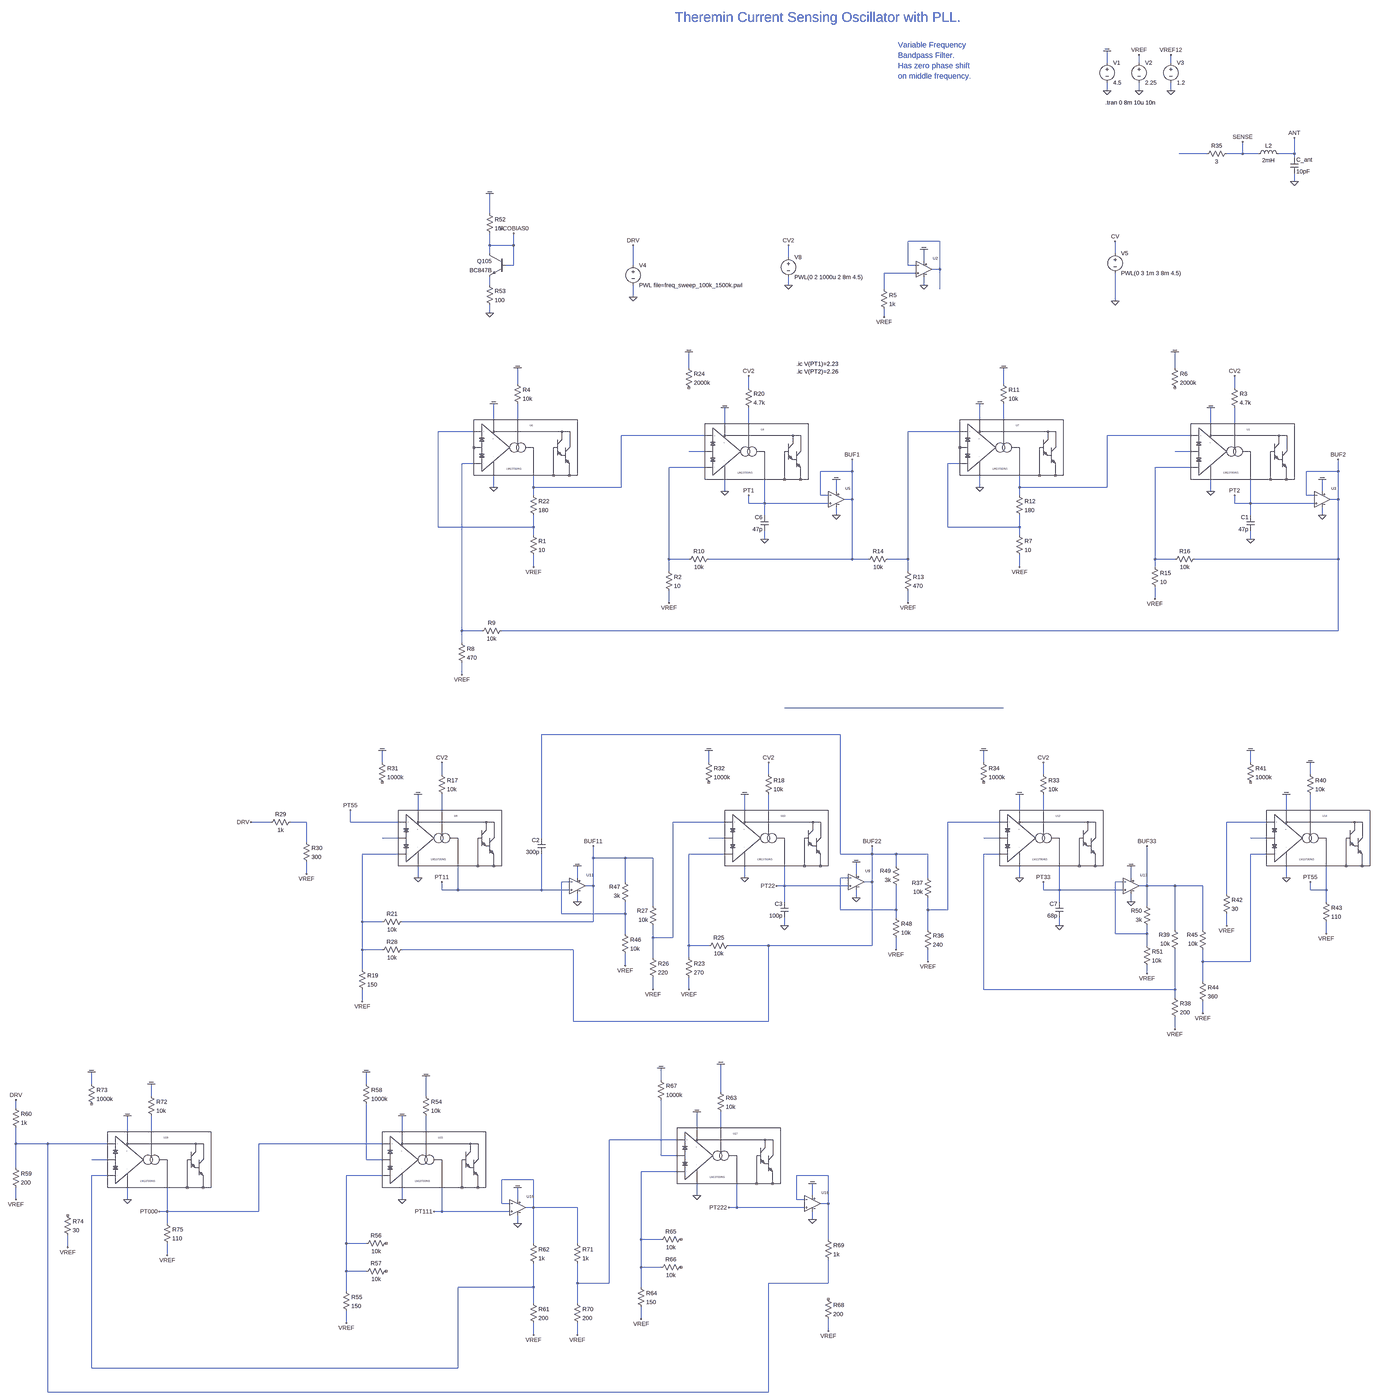
[diagram p0: schematic vco_and_lc_drive_v17.asc, whole sheet]
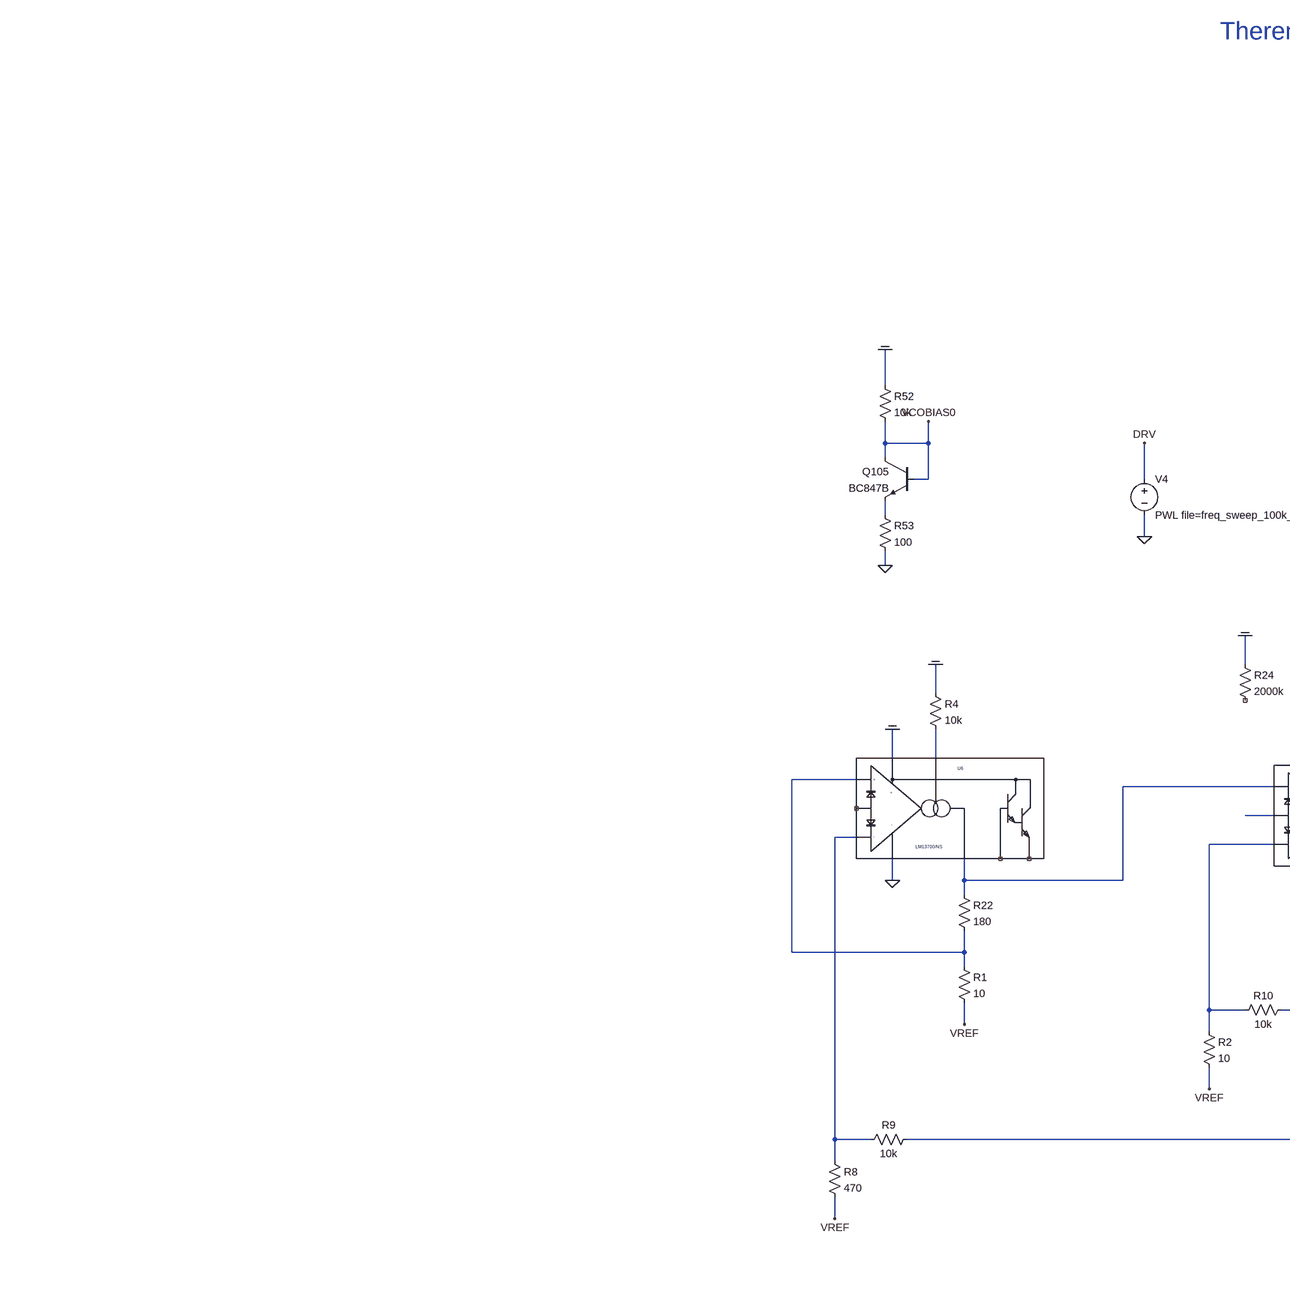
[diagram p1: schematic vco_and_lc_drive_v17.asc, part, row 1 of 2, column 1 of 2]
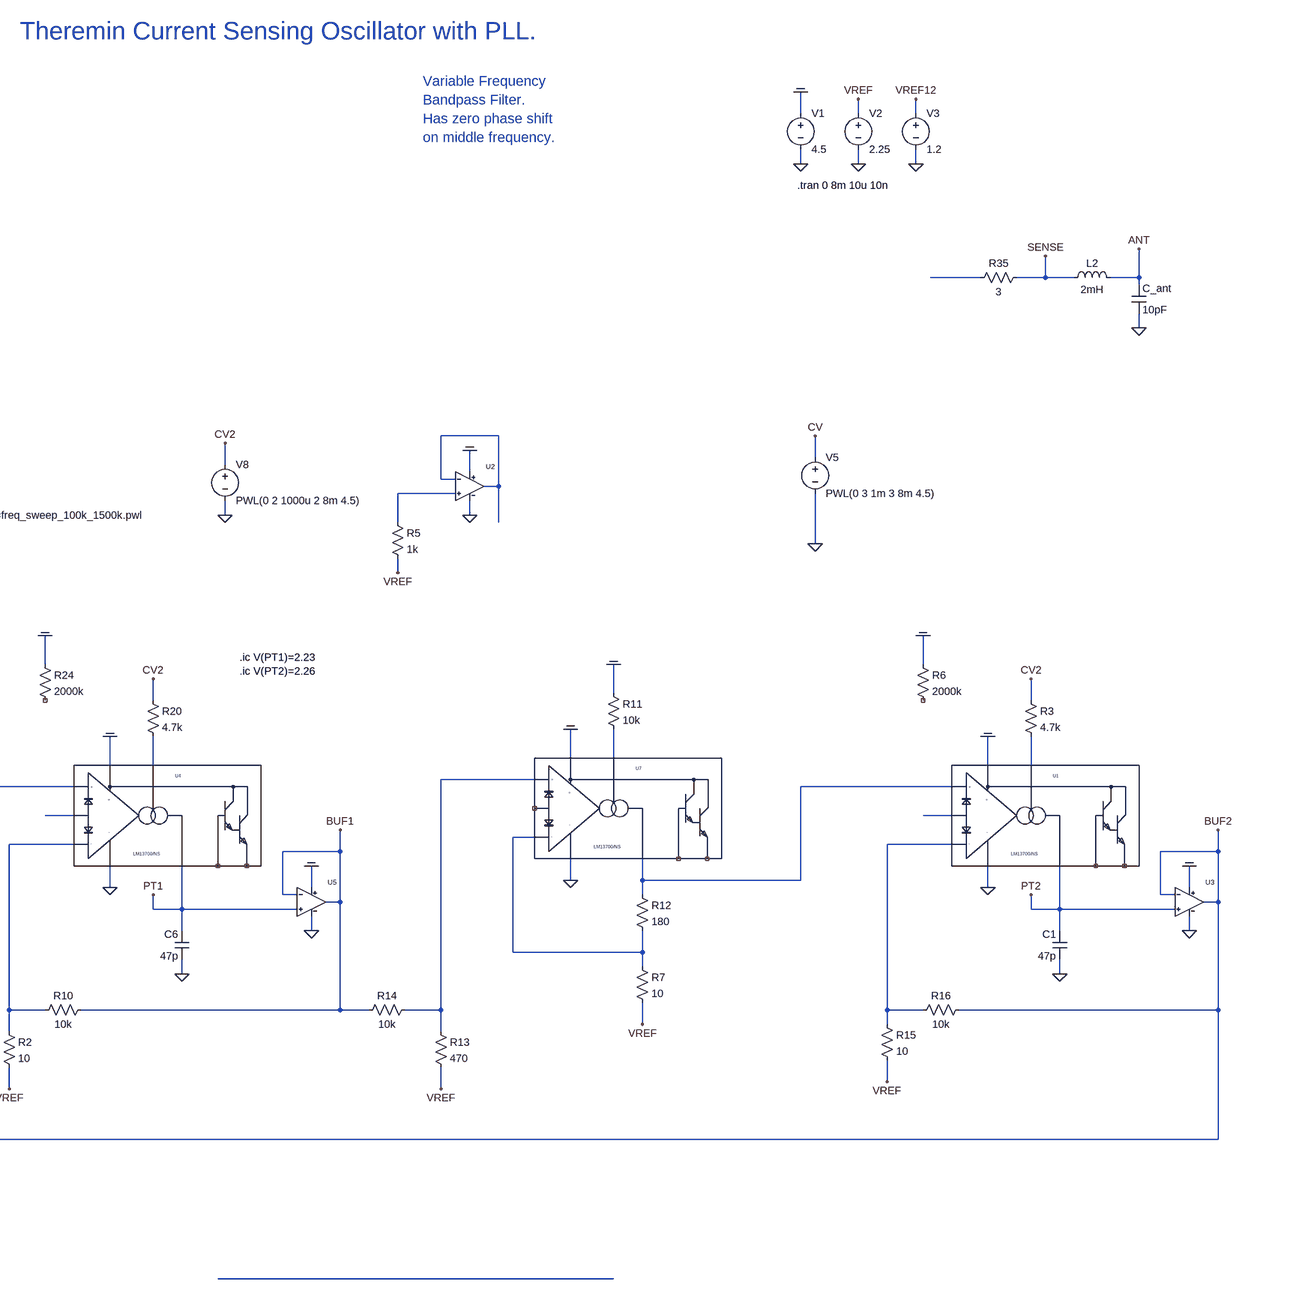
[diagram p2: schematic vco_and_lc_drive_v17.asc, part, row 1 of 2, column 2 of 2]
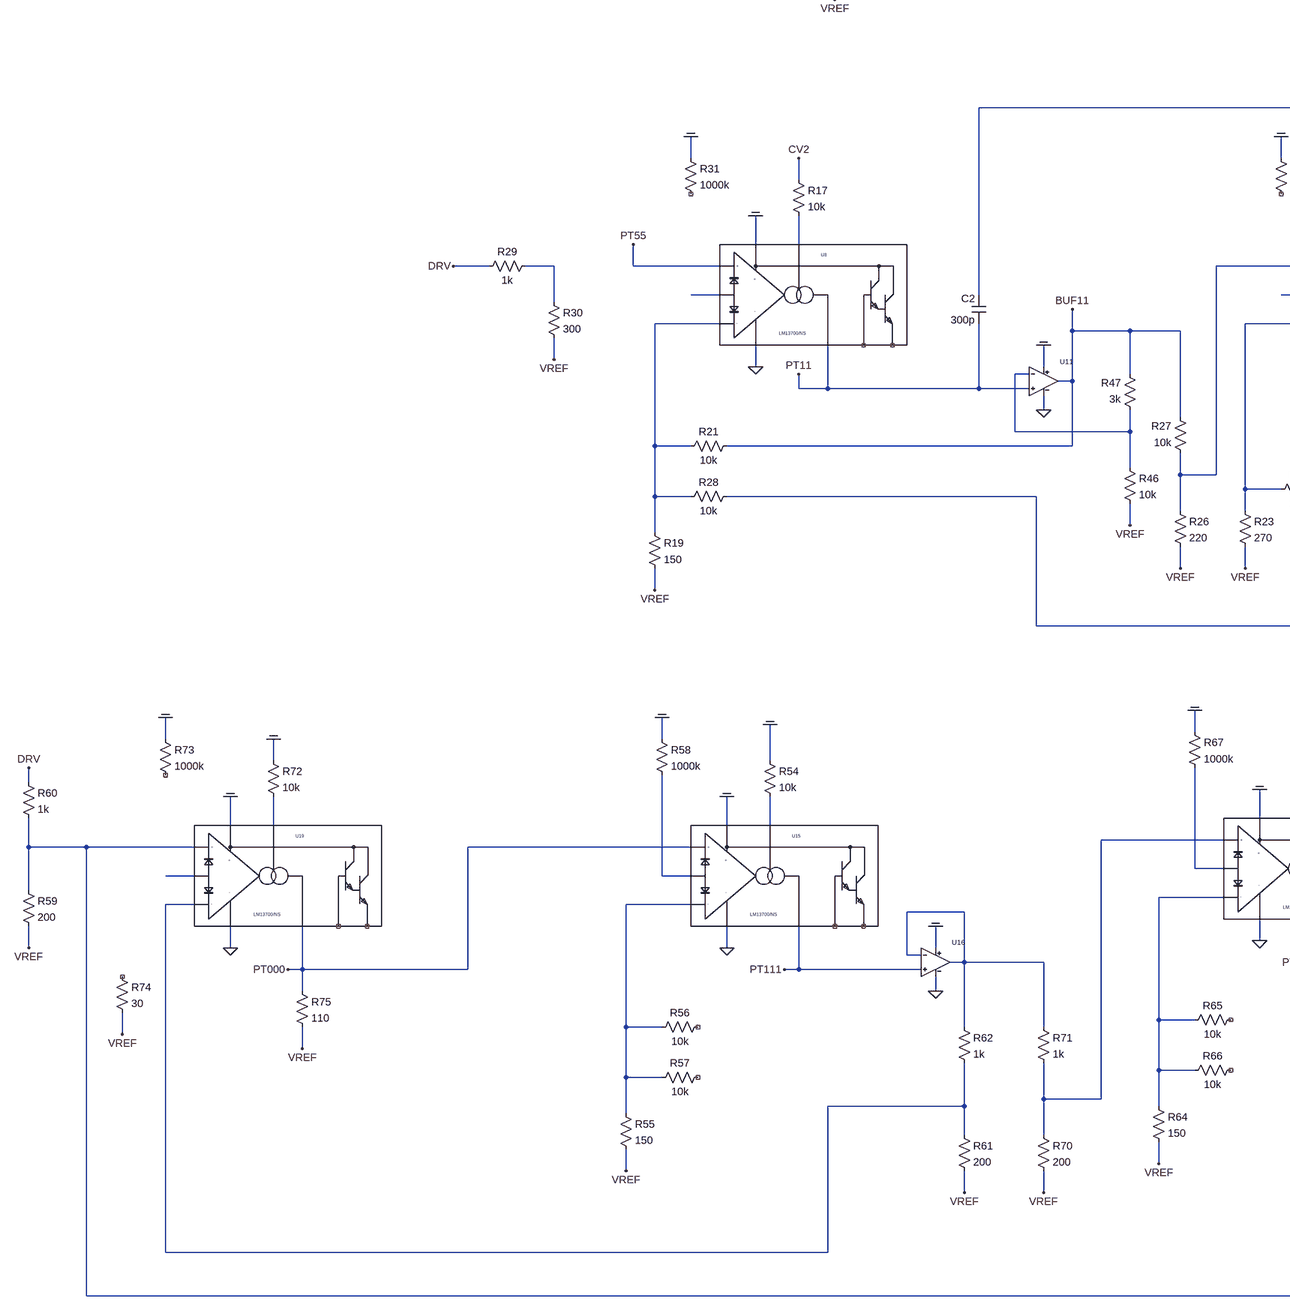
[diagram p3: schematic vco_and_lc_drive_v17.asc, part, row 2 of 2, column 1 of 2]
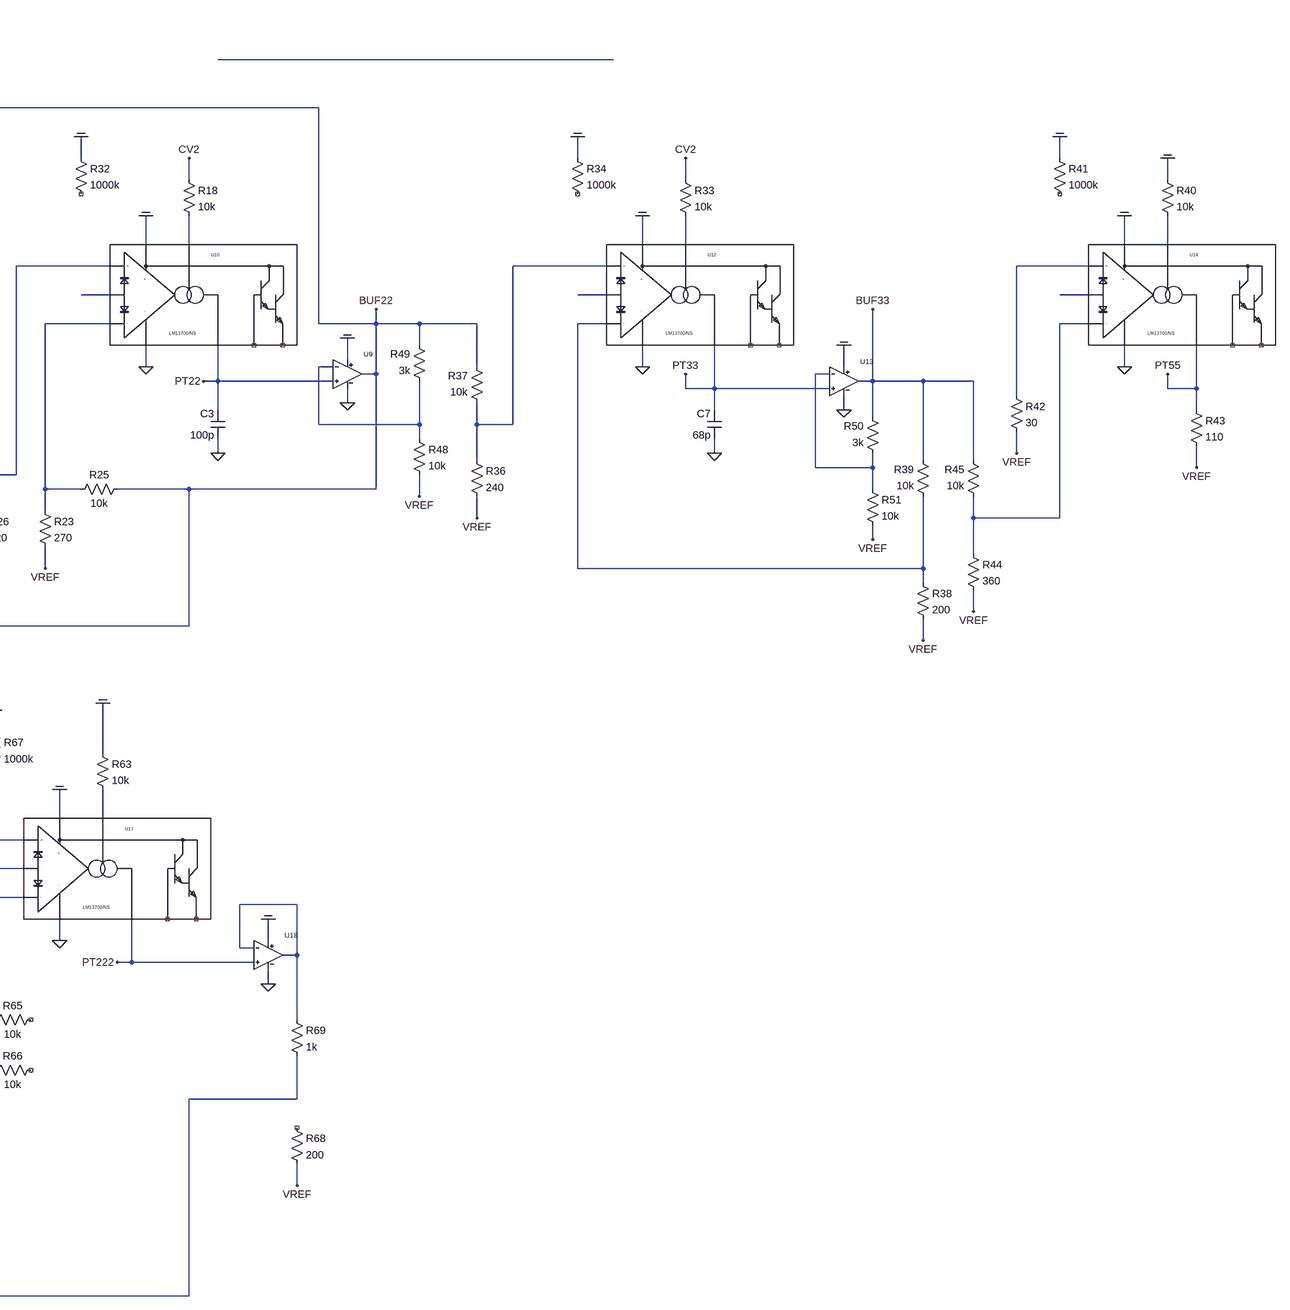
[diagram p4: schematic vco_and_lc_drive_v17.asc, part, row 2 of 2, column 2 of 2]
vco_and_lc_drive_v17.asc, the LTspice schematic file:
Version 4
SHEET 1 13504 29468
WIRE -5600 19072 -5600 19024
WIRE -5472 19072 -5472 19040
WIRE -5344 19072 -5344 19040
WIRE -5600 19184 -5600 19152
WIRE -5472 19184 -5472 19152
WIRE -5344 19184 -5344 19152
WIRE -5200 19440 -5312 19440
WIRE -5056 19440 -5056 19392
WIRE -5056 19440 -5120 19440
WIRE -4992 19440 -5056 19440
WIRE -4848 19440 -4848 19376
WIRE -4848 19440 -4912 19440
WIRE -4848 19456 -4848 19440
WIRE -4848 19552 -4848 19520
WIRE -8080 19680 -8080 19600
WIRE -6272 19792 -6400 19792
WIRE -8080 19808 -8080 19760
WIRE -7984 19808 -7984 19760
WIRE -7984 19808 -8080 19808
WIRE -8080 19840 -8080 19808
WIRE -5568 19840 -5568 19792
WIRE -6880 19856 -6880 19808
WIRE -6336 19872 -6336 19824
WIRE -7984 19888 -7984 19808
WIRE -7984 19888 -8016 19888
WIRE -7504 19888 -7504 19808
WIRE -6400 19888 -6400 19792
WIRE -6368 19888 -6400 19888
WIRE -6272 19904 -6272 19792
WIRE -6272 19904 -6304 19904
WIRE -6368 19920 -6496 19920
WIRE -8080 19968 -8080 19936
WIRE -6880 19968 -6880 19936
WIRE -6336 19968 -6336 19936
WIRE -6496 19984 -6496 19920
WIRE -6272 19984 -6272 19904
WIRE -7504 20016 -7504 19968
WIRE -5568 20032 -5568 19920
WIRE -8080 20080 -8080 20048
WIRE -6496 20096 -6496 20064
WIRE -7280 20400 -7280 20336
WIRE -5328 20400 -5328 20336
WIRE -7968 20464 -7968 20400
WIRE -6016 20464 -6016 20400
WIRE -7040 20480 -7040 20432
WIRE -5088 20480 -5088 20432
WIRE -8064 20608 -8064 20544
WIRE -7968 20608 -7968 20544
WIRE -6112 20608 -6112 20544
WIRE -6016 20608 -6016 20544
WIRE -7136 20624 -7136 20560
WIRE -7040 20624 -7040 20560
WIRE -5184 20624 -5184 20560
WIRE -5088 20624 -5088 20560
WIRE -8144 20656 -8288 20656
WIRE -6192 20656 -6400 20656
WIRE -7216 20672 -7552 20672
WIRE -5264 20672 -5600 20672
WIRE -7216 20736 -7280 20736
WIRE -5264 20736 -5328 20736
WIRE -8144 20784 -8192 20784
WIRE -6192 20784 -6240 20784
WIRE -7216 20800 -7360 20800
WIRE -5264 20800 -5408 20800
WIRE -6624 20816 -6624 20768
WIRE -6624 20816 -6752 20816
WIRE -4672 20816 -4672 20768
WIRE -4672 20816 -4800 20816
WIRE -8064 20880 -8064 20832
WIRE -7904 20880 -7904 20832
WIRE -7552 20880 -7552 20672
WIRE -7552 20880 -7904 20880
WIRE -6112 20880 -6112 20832
WIRE -5952 20880 -5952 20832
WIRE -5600 20880 -5600 20672
WIRE -5600 20880 -5952 20880
WIRE -7136 20896 -7136 20848
WIRE -6688 20896 -6688 20848
WIRE -5184 20896 -5184 20848
WIRE -4736 20896 -4736 20848
WIRE -7904 20912 -7904 20880
WIRE -6752 20912 -6752 20816
WIRE -6720 20912 -6752 20912
WIRE -5952 20912 -5952 20880
WIRE -4800 20912 -4800 20816
WIRE -4768 20912 -4800 20912
WIRE -6624 20928 -6624 20816
WIRE -6624 20928 -6656 20928
WIRE -4672 20928 -4672 20816
WIRE -4672 20928 -4704 20928
WIRE -7040 20944 -7040 20912
WIRE -6976 20944 -6976 20848
WIRE -6976 20944 -7040 20944
WIRE -6720 20944 -6976 20944
WIRE -5088 20944 -5088 20912
WIRE -5024 20944 -5024 20848
WIRE -5024 20944 -5088 20944
WIRE -4768 20944 -5024 20944
WIRE -6976 20992 -6976 20944
WIRE -6688 20992 -6688 20960
WIRE -5024 20992 -5024 20944
WIRE -4736 20992 -4736 20960
WIRE -8288 21040 -8288 20656
WIRE -7904 21040 -7904 20992
WIRE -7904 21040 -8288 21040
WIRE -6240 21040 -6240 20784
WIRE -5952 21040 -5952 20992
WIRE -5952 21040 -6240 21040
WIRE -7904 21072 -7904 21040
WIRE -5952 21072 -5952 21040
WIRE -6976 21088 -6976 21056
WIRE -5024 21088 -5024 21056
WIRE -7360 21168 -7360 20800
WIRE -7280 21168 -7360 21168
WIRE -6624 21168 -6624 20928
WIRE -6624 21168 -7200 21168
WIRE -6560 21168 -6624 21168
WIRE -6400 21168 -6400 20656
WIRE -6400 21168 -6480 21168
WIRE -5408 21168 -5408 20800
WIRE -5328 21168 -5408 21168
WIRE -4672 21168 -4672 20928
WIRE -4672 21168 -5248 21168
WIRE -7904 21200 -7904 21152
WIRE -5952 21200 -5952 21152
WIRE -5408 21200 -5408 21168
WIRE -7360 21216 -7360 21168
WIRE -6400 21216 -6400 21168
WIRE -5408 21328 -5408 21280
WIRE -7360 21344 -7360 21296
WIRE -6400 21344 -6400 21296
WIRE -8192 21456 -8192 20784
WIRE -8112 21456 -8192 21456
WIRE -4672 21456 -4672 21168
WIRE -4672 21456 -8032 21456
WIRE -8192 21504 -8192 21456
WIRE -8192 21632 -8192 21584
WIRE -6016 22224 -6896 22224
WIRE -6672 22784 -7872 22784
WIRE -8512 22896 -8512 22848
WIRE -7200 22896 -7200 22848
WIRE -6096 22896 -6096 22848
WIRE -5024 22896 -5024 22848
WIRE -8272 22944 -8272 22896
WIRE -6960 22944 -6960 22896
WIRE -5856 22944 -5856 22896
WIRE -4784 22944 -4784 22896
WIRE -8368 23088 -8368 23024
WIRE -8272 23088 -8272 23024
WIRE -7056 23088 -7056 23024
WIRE -6960 23088 -6960 23024
WIRE -5952 23088 -5952 23024
WIRE -5856 23088 -5856 23024
WIRE -4880 23088 -4880 23024
WIRE -4784 23088 -4784 23024
WIRE -8960 23136 -9040 23136
WIRE -8816 23136 -8880 23136
WIRE -8640 23136 -8640 23088
WIRE -8448 23136 -8640 23136
WIRE -7136 23136 -7344 23136
WIRE -6032 23136 -6240 23136
WIRE -4960 23136 -5120 23136
WIRE -8448 23200 -8512 23200
WIRE -7872 23200 -7872 22784
WIRE -7136 23200 -7200 23200
WIRE -6032 23200 -6096 23200
WIRE -4960 23200 -5024 23200
WIRE -8816 23216 -8816 23136
WIRE -8448 23264 -8592 23264
WIRE -7136 23264 -7280 23264
WIRE -6672 23264 -6672 22784
WIRE -6544 23264 -6544 23232
WIRE -6544 23264 -6672 23264
WIRE -6448 23264 -6544 23264
WIRE -6320 23264 -6448 23264
WIRE -6032 23264 -6096 23264
WIRE -4960 23264 -5024 23264
WIRE -7664 23280 -7664 23232
WIRE -7536 23280 -7664 23280
WIRE -7424 23280 -7536 23280
WIRE -6448 23312 -6448 23264
WIRE -8816 23344 -8816 23296
WIRE -6608 23344 -6608 23296
WIRE -8368 23360 -8368 23312
WIRE -7728 23360 -7728 23312
WIRE -7056 23360 -7056 23312
WIRE -6640 23360 -6672 23360
WIRE -6320 23360 -6320 23264
WIRE -5952 23360 -5952 23312
WIRE -5504 23360 -5504 23312
WIRE -4880 23360 -4880 23312
WIRE -7760 23376 -7792 23376
WIRE -7536 23376 -7536 23280
WIRE -6544 23376 -6544 23264
WIRE -6544 23376 -6576 23376
WIRE -5536 23376 -5568 23376
WIRE -7664 23392 -7664 23280
WIRE -7664 23392 -7696 23392
WIRE -6896 23392 -6896 23312
WIRE -6896 23392 -6928 23392
WIRE -6640 23392 -6896 23392
WIRE -5440 23392 -5440 23232
WIRE -5440 23392 -5472 23392
WIRE -5328 23392 -5440 23392
WIRE -5216 23392 -5328 23392
WIRE -8272 23408 -8272 23376
WIRE -8208 23408 -8208 23312
WIRE -8208 23408 -8272 23408
WIRE -7872 23408 -7872 23264
WIRE -7872 23408 -8208 23408
WIRE -7760 23408 -7872 23408
WIRE -5856 23408 -5856 23376
WIRE -5792 23408 -5792 23312
WIRE -5792 23408 -5856 23408
WIRE -5536 23408 -5792 23408
WIRE -4784 23408 -4784 23376
WIRE -4720 23408 -4720 23312
WIRE -4720 23408 -4784 23408
WIRE -5120 23424 -5120 23136
WIRE -6608 23440 -6608 23408
WIRE -7728 23456 -7728 23424
WIRE -6896 23456 -6896 23392
WIRE -5792 23456 -5792 23408
WIRE -5504 23456 -5504 23424
WIRE -4720 23456 -4720 23408
WIRE -7424 23472 -7424 23280
WIRE -5440 23472 -5440 23392
WIRE -6672 23488 -6672 23360
WIRE -6448 23488 -6448 23392
WIRE -6448 23488 -6672 23488
WIRE -6320 23488 -6320 23440
WIRE -6240 23488 -6240 23136
WIRE -6240 23488 -6320 23488
WIRE -7792 23504 -7792 23376
WIRE -7536 23504 -7536 23456
WIRE -7536 23504 -7792 23504
WIRE -6448 23520 -6448 23488
WIRE -8592 23536 -8592 23264
WIRE -8512 23536 -8592 23536
WIRE -7664 23536 -7664 23392
WIRE -7664 23536 -8432 23536
WIRE -6896 23552 -6896 23520
WIRE -5792 23552 -5792 23520
WIRE -5120 23552 -5120 23504
WIRE -6320 23568 -6320 23488
WIRE -5328 23568 -5328 23392
WIRE -5216 23568 -5216 23392
WIRE -7536 23584 -7536 23504
WIRE -5568 23584 -5568 23376
WIRE -5440 23584 -5440 23552
WIRE -5440 23584 -5568 23584
WIRE -4720 23584 -4720 23536
WIRE -7424 23600 -7424 23552
WIRE -7344 23600 -7344 23136
WIRE -7344 23600 -7424 23600
WIRE -7280 23632 -7280 23264
WIRE -7200 23632 -7280 23632
WIRE -6960 23632 -7120 23632
WIRE -6544 23632 -6544 23376
WIRE -6544 23632 -6960 23632
WIRE -5440 23632 -5440 23584
WIRE -8592 23648 -8592 23536
WIRE -8512 23648 -8592 23648
WIRE -7744 23648 -8432 23648
WIRE -6448 23648 -6448 23600
WIRE -7424 23680 -7424 23600
WIRE -7280 23680 -7280 23632
WIRE -6320 23696 -6320 23648
WIRE -5216 23696 -5216 23648
WIRE -5024 23696 -5024 23264
WIRE -5024 23696 -5216 23696
WIRE -7536 23712 -7536 23664
WIRE -8592 23728 -8592 23648
WIRE -5440 23744 -5440 23712
WIRE -5216 23776 -5216 23696
WIRE -7424 23808 -7424 23760
WIRE -7280 23808 -7280 23760
WIRE -6096 23808 -6096 23264
WIRE -5328 23808 -5328 23648
WIRE -5328 23808 -6096 23808
WIRE -5328 23840 -5328 23808
WIRE -8592 23856 -8592 23808
WIRE -5216 23904 -5216 23856
WIRE -7744 23936 -7744 23648
WIRE -6960 23936 -6960 23632
WIRE -6960 23936 -7744 23936
WIRE -5328 23968 -5328 23920
WIRE -7392 24608 -7392 24560
WIRE -9696 24624 -9696 24576
WIRE -8576 24624 -8576 24576
WIRE -7152 24656 -7152 24544
WIRE -9456 24672 -9456 24624
WIRE -8336 24672 -8336 24592
WIRE -10000 24720 -10000 24688
WIRE -7248 24800 -7248 24736
WIRE -7152 24800 -7152 24736
WIRE -9552 24816 -9552 24752
WIRE -9456 24816 -9456 24752
WIRE -8432 24816 -8432 24752
WIRE -8336 24816 -8336 24752
WIRE -7328 24848 -7600 24848
WIRE -10000 24864 -10000 24800
WIRE -9872 24864 -10000 24864
WIRE -9632 24864 -9872 24864
WIRE -8512 24864 -9008 24864
WIRE -7392 24912 -7392 24688
WIRE -7328 24912 -7392 24912
WIRE -9632 24928 -9696 24928
WIRE -8576 24928 -8576 24704
WIRE -8512 24928 -8576 24928
WIRE -10000 24960 -10000 24864
WIRE -7328 24976 -7472 24976
WIRE -9632 24992 -9696 24992
WIRE -8512 24992 -8656 24992
WIRE -6720 24992 -6848 24992
WIRE -7904 25008 -8032 25008
WIRE -7248 25072 -7248 25024
WIRE -6784 25072 -6784 25024
WIRE -10000 25088 -10000 25040
WIRE -9552 25088 -9552 25040
WIRE -8432 25088 -8432 25040
WIRE -7968 25088 -7968 25040
WIRE -6848 25088 -6848 24992
WIRE -6816 25088 -6848 25088
WIRE -8032 25104 -8032 25008
WIRE -8000 25104 -8032 25104
WIRE -6720 25104 -6720 24992
WIRE -6720 25104 -6752 25104
WIRE -7904 25120 -7904 25008
WIRE -7904 25120 -7936 25120
WIRE -7728 25120 -7904 25120
WIRE -7088 25120 -7088 25024
WIRE -7088 25120 -7120 25120
WIRE -6816 25120 -7088 25120
WIRE -9392 25136 -9392 25040
WIRE -9392 25136 -9424 25136
WIRE -9008 25136 -9008 24864
WIRE -9008 25136 -9392 25136
WIRE -8272 25136 -8272 25040
WIRE -8272 25136 -8304 25136
WIRE -8000 25136 -8272 25136
WIRE -6784 25168 -6784 25136
WIRE -9392 25184 -9392 25136
WIRE -7968 25184 -7968 25152
WIRE -7472 25248 -7472 24976
WIRE -7392 25248 -7472 25248
WIRE -6720 25248 -6720 25104
WIRE -8656 25264 -8656 24992
WIRE -8576 25264 -8656 25264
WIRE -7904 25264 -7904 25120
WIRE -7728 25264 -7728 25120
WIRE -9792 25280 -9792 25232
WIRE -9392 25312 -9392 25264
WIRE -7472 25360 -7472 25248
WIRE -7392 25360 -7472 25360
WIRE -8656 25376 -8656 25264
WIRE -8576 25376 -8656 25376
WIRE -7728 25424 -7728 25344
WIRE -7600 25424 -7600 24848
WIRE -7600 25424 -7728 25424
WIRE -6720 25424 -6720 25328
WIRE -6720 25424 -6960 25424
WIRE -7904 25440 -7904 25344
WIRE -7904 25440 -8208 25440
WIRE -7472 25440 -7472 25360
WIRE -8656 25456 -8656 25376
WIRE -7904 25504 -7904 25440
WIRE -7728 25504 -7728 25424
WIRE -7472 25568 -7472 25520
WIRE -8656 25584 -8656 25536
WIRE -6720 25616 -6720 25568
WIRE -7904 25632 -7904 25584
WIRE -7728 25632 -7728 25584
WIRE -9696 25792 -9696 24992
WIRE -8208 25792 -8208 25440
WIRE -8208 25792 -9696 25792
WIRE -9872 25888 -9872 24864
WIRE -6960 25888 -6960 25424
WIRE -6960 25888 -9872 25888
FLAG -5600 19184 0
FLAG -5600 19024 COM
FLAG -5472 19184 0
FLAG -5472 19040 VREF
FLAG -4848 19376 ANT
FLAG -5056 19392 SENSE
FLAG -5344 19184 0
FLAG -5344 19040 VREF12
FLAG -8080 19600 COM
FLAG -8080 20080 0
FLAG -7984 19760 VCOBIAS0
FLAG -4848 19552 0
FLAG -7504 20016 0
FLAG -7504 19808 DRV
FLAG -6336 19968 0
FLAG -5568 19792 CV
FLAG -5568 20032 0
FLAG -6880 19808 CV2
FLAG -6880 19968 0
FLAG -6336 19824 COM
FLAG -6496 20096 VREF
FLAG -7136 20896 0
FLAG -7136 20560 COM
FLAG -7040 20432 CV2
FLAG -6976 21088 0
FLAG -7280 20336 COM
FLAG -7040 20912 PT1
FLAG -6688 20992 0
FLAG -6688 20848 COM
FLAG -6624 20768 BUF1
FLAG -8064 20880 0
FLAG -8064 20544 COM
FLAG -7968 20400 COM
FLAG -7904 21200 VREF
FLAG -8192 21632 VREF
FLAG -7360 21344 VREF
FLAG -5184 20896 0
FLAG -5184 20560 COM
FLAG -5088 20432 CV2
FLAG -5024 21088 0
FLAG -5328 20336 COM
FLAG -5088 20912 PT2
FLAG -4736 20992 0
FLAG -4736 20848 COM
FLAG -4672 20768 BUF2
FLAG -6112 20880 0
FLAG -6112 20544 COM
FLAG -6016 20400 COM
FLAG -5952 21200 VREF
FLAG -6400 21344 VREF
FLAG -5408 21328 VREF
FLAG -8368 23360 0
FLAG -8368 23024 COM
FLAG -8272 23376 PT11
FLAG -7664 23232 BUF11
FLAG -8592 23856 VREF
FLAG -7056 23360 0
FLAG -7056 23024 COM
FLAG -6896 23552 0
FLAG -6928 23392 PT22
FLAG -6544 23232 BUF22
FLAG -7280 23808 VREF
FLAG -7424 23808 VREF
FLAG -9040 23136 DRV
FLAG -8816 23344 VREF
FLAG -8512 22848 COM
FLAG -7200 22848 COM
FLAG -5952 23360 0
FLAG -5952 23024 COM
FLAG -5856 23376 PT33
FLAG -5504 23456 0
FLAG -5504 23312 COM
FLAG -5440 23232 BUF33
FLAG -6096 22848 COM
FLAG -6320 23696 VREF
FLAG -5328 23968 VREF
FLAG -5792 23552 0
FLAG -4880 23360 0
FLAG -4880 23024 COM
FLAG -4784 23376 PT55
FLAG -4784 22896 COM
FLAG -5024 22848 COM
FLAG -5120 23552 VREF
FLAG -4720 23584 VREF
FLAG -5216 23904 VREF
FLAG -8640 23088 PT55
FLAG -5856 22896 CV2
FLAG -6960 22896 CV2
FLAG -8272 22896 CV2
FLAG -6608 23440 0
FLAG -6608 23296 COM
FLAG -7728 23456 0
FLAG -7728 23312 COM
FLAG -7536 23712 VREF
FLAG -6448 23648 VREF
FLAG -5440 23744 VREF
FLAG -8432 25088 0
FLAG -8432 24752 COM
FLAG -8304 25136 PT111
FLAG -8656 25584 VREF
FLAG -8576 24576 COM
FLAG -7968 25184 0
FLAG -7968 25040 COM
FLAG -10000 24688 DRV
FLAG -10000 25088 VREF
FLAG -7904 25632 VREF
FLAG -7248 25072 0
FLAG -7248 24736 COM
FLAG -7120 25120 PT222
FLAG -7472 25568 VREF
FLAG -7392 24560 COM
FLAG -6784 25168 0
FLAG -6784 25024 COM
FLAG -6720 25616 VREF
FLAG -7728 25632 VREF
FLAG -9552 25088 0
FLAG -9552 24752 COM
FLAG -9424 25136 PT000
FLAG -9456 24624 COM
FLAG -9696 24576 COM
FLAG -9792 25280 VREF
FLAG -9392 25312 VREF
FLAG -8336 24592 COM
FLAG -7152 24544 COM
SYMBOL voltage -5600 19056 R0
SYMATTR InstName V1
SYMATTR Value 4.5
SYMBOL Voltage -5472 19056 R0
SYMATTR InstName V2
SYMATTR Value 2.25
SYMBOL ind -5008 19456 R270
WINDOW 0 32 56 VTop 2
WINDOW 3 5 56 VBottom 2
SYMATTR InstName L2
SYMATTR Value 2mH
SYMATTR SpiceLine Rser=120 Cpar=1pF
SYMBOL Cap -4864 19456 R0
SYMATTR InstName C_ant
SYMATTR Value 10pF
SYMBOL Res -5216 19456 R270
WINDOW 0 32 56 VTop 2
WINDOW 3 0 56 VBottom 2
SYMATTR InstName R35
SYMATTR Value 3
SYMBOL Voltage -5344 19056 R0
SYMATTR InstName V3
SYMATTR Value 1.2
SYMBOL npn -8016 19840 M0
SYMATTR InstName Q105
SYMATTR Value BC847B
SYMBOL Res -8096 19664 R0
SYMATTR InstName R52
SYMATTR Value 10k
SYMBOL Res -8096 19952 R0
SYMATTR InstName R53
SYMATTR Value 100
SYMBOL Voltage -7504 19872 R0
SYMATTR InstName V4
SYMATTR Value PWL file=freq_sweep_100k_1500k.pwl
SYMBOL MCP6021 -6336 19904 R0
SYMATTR InstName U2
SYMBOL Voltage -5568 19824 R0
SYMATTR InstName V5
SYMATTR Value PWL(0 3 1m 3 8m 4.5)
SYMBOL Voltage -6880 19840 R0
SYMATTR InstName V8
SYMATTR Value PWL(0 2 1000u 2 8m 4.5)
SYMBOL Res -6512 19968 R0
SYMATTR InstName R5
SYMATTR Value 1k
SYMBOL LM13700 -7136 20736 R0
SYMATTR InstName U4
SYMBOL Res -7056 20464 R0
SYMATTR InstName R20
SYMATTR Value 4.7k
SYMBOL Cap -6960 21056 R180
WINDOW 0 24 56 Left 2
WINDOW 3 24 8 Left 2
SYMATTR InstName C6
SYMATTR Value 47p
SYMBOL Res -7296 20384 R0
SYMATTR InstName R24
SYMATTR Value 2000k
SYMBOL Res -7920 21056 R0
SYMATTR InstName R1
SYMATTR Value 10
SYMBOL MCP6021 -6688 20928 R0
SYMATTR InstName U5
SYMBOL LM13700 -8064 20720 R0
SYMATTR InstName U6
SYMBOL Res -7984 20448 R0
SYMATTR InstName R4
SYMATTR Value 10k
SYMBOL Res -7920 20896 R0
SYMATTR InstName R22
SYMATTR Value 180
SYMBOL Res -8208 21488 R0
SYMATTR InstName R8
SYMATTR Value 470
SYMBOL Res -8016 21440 R90
WINDOW 0 0 56 VBottom 2
WINDOW 3 32 56 VTop 2
SYMATTR InstName R9
SYMATTR Value 10k
SYMBOL Res -7376 21200 R0
SYMATTR InstName R2
SYMATTR Value 10
SYMBOL Res -7184 21152 R90
WINDOW 0 0 56 VBottom 2
WINDOW 3 32 56 VTop 2
SYMATTR InstName R10
SYMATTR Value 10k
SYMBOL LM13700 -5184 20736 R0
SYMATTR InstName U1
SYMBOL Res -5104 20464 R0
SYMATTR InstName R3
SYMATTR Value 4.7k
SYMBOL Cap -5008 21056 R180
WINDOW 0 24 56 Left 2
WINDOW 3 24 8 Left 2
SYMATTR InstName C1
SYMATTR Value 47p
SYMBOL Res -5344 20384 R0
SYMATTR InstName R6
SYMATTR Value 2000k
SYMBOL Res -5968 21056 R0
SYMATTR InstName R7
SYMATTR Value 10
SYMBOL MCP6021 -4736 20928 R0
SYMATTR InstName U3
SYMBOL LM13700 -6112 20720 R0
SYMATTR InstName U7
SYMBOL Res -6032 20448 R0
SYMATTR InstName R11
SYMATTR Value 10k
SYMBOL Res -5968 20896 R0
SYMATTR InstName R12
SYMATTR Value 180
SYMBOL Res -6416 21200 R0
SYMATTR InstName R13
SYMATTR Value 470
SYMBOL Res -6464 21152 R90
WINDOW 0 0 56 VBottom 2
WINDOW 3 32 56 VTop 2
SYMATTR InstName R14
SYMATTR Value 10k
SYMBOL Res -5424 21184 R0
SYMATTR InstName R15
SYMATTR Value 10
SYMBOL Res -5232 21152 R90
WINDOW 0 0 56 VBottom 2
WINDOW 3 32 56 VTop 2
SYMATTR InstName R16
SYMATTR Value 10k
SYMBOL LM13700 -8368 23200 R0
SYMATTR InstName U8
SYMBOL Res -8288 22928 R0
SYMATTR InstName R17
SYMATTR Value 10k
SYMBOL Cap -7856 23264 R180
WINDOW 0 24 56 Left 2
WINDOW 3 24 8 Left 2
SYMATTR InstName C2
SYMATTR Value 300p
SYMBOL Res -8608 23712 R0
SYMATTR InstName R19
SYMATTR Value 150
SYMBOL Res -8416 23520 R90
WINDOW 0 0 56 VBottom 2
WINDOW 3 32 56 VTop 2
SYMATTR InstName R21
SYMATTR Value 10k
SYMBOL LM13700 -7056 23200 R0
SYMATTR InstName U10
SYMBOL Res -6976 22928 R0
SYMATTR InstName R18
SYMATTR Value 10k
SYMBOL Cap -6880 23520 R180
WINDOW 0 24 56 Left 2
WINDOW 3 24 8 Left 2
SYMATTR InstName C3
SYMATTR Value 100p
SYMBOL Res -7296 23664 R0
SYMATTR InstName R23
SYMATTR Value 270
SYMBOL Res -7104 23616 R90
WINDOW 0 0 56 VBottom 2
WINDOW 3 32 56 VTop 2
SYMATTR InstName R25
SYMATTR Value 10k
SYMBOL Res -7440 23664 R0
SYMATTR InstName R26
SYMATTR Value 220
SYMBOL Res -7408 23568 R180
WINDOW 0 36 76 Left 2
WINDOW 3 36 40 Left 2
SYMATTR InstName R27
SYMATTR Value 10k
SYMBOL Res -8416 23632 R90
WINDOW 0 0 56 VBottom 2
WINDOW 3 32 56 VTop 2
SYMATTR InstName R28
SYMATTR Value 10k
SYMBOL Res -8864 23120 R90
WINDOW 0 0 56 VBottom 2
WINDOW 3 32 56 VTop 2
SYMATTR InstName R29
SYMATTR Value 1k
SYMBOL Res -8832 23200 R0
SYMATTR InstName R30
SYMATTR Value 300
SYMBOL Res -8528 22880 R0
SYMATTR InstName R31
SYMATTR Value 1000k
SYMBOL Res -7216 22880 R0
SYMATTR InstName R32
SYMATTR Value 1000k
SYMBOL LM13700 -5952 23200 R0
SYMATTR InstName U12
SYMBOL Res -5872 22928 R0
SYMATTR InstName R33
SYMATTR Value 10k
SYMBOL MCP6021 -5504 23392 R0
SYMATTR InstName U13
SYMBOL Res -6112 22880 R0
SYMATTR InstName R34
SYMATTR Value 1000k
SYMBOL Res -6336 23552 R0
SYMATTR InstName R36
SYMATTR Value 240
SYMBOL Res -6304 23456 R180
WINDOW 0 36 76 Left 2
WINDOW 3 36 40 Left 2
SYMATTR InstName R37
SYMATTR Value 10k
SYMBOL Res -5344 23824 R0
SYMATTR InstName R38
SYMATTR Value 200
SYMBOL Res -5312 23664 R180
WINDOW 0 36 76 Left 2
WINDOW 3 36 40 Left 2
SYMATTR InstName R39
SYMATTR Value 10k
SYMBOL Cap -5776 23520 R180
WINDOW 0 24 56 Left 2
WINDOW 3 24 8 Left 2
SYMATTR InstName C7
SYMATTR Value 68p
SYMBOL LM13700 -4880 23200 R0
SYMATTR InstName U14
SYMBOL Res -4800 22928 R0
SYMATTR InstName R40
SYMATTR Value 10k
SYMBOL Res -5040 22880 R0
SYMATTR InstName R41
SYMATTR Value 1000k
SYMBOL Res -5136 23408 R0
SYMATTR InstName R42
SYMATTR Value 30
SYMBOL Res -4736 23440 R0
SYMATTR InstName R43
SYMATTR Value 110
SYMBOL Res -5232 23760 R0
SYMATTR InstName R44
SYMATTR Value 360
SYMBOL Res -5200 23664 R180
WINDOW 0 36 76 Left 2
WINDOW 3 36 40 Left 2
SYMATTR InstName R45
SYMATTR Value 10k
SYMBOL MCP6021 -6608 23376 R0
SYMATTR InstName U9
SYMBOL MCP6021 -7728 23392 R0
SYMATTR InstName U11
SYMBOL Res -7552 23568 R0
SYMATTR InstName R46
SYMATTR Value 10k
SYMBOL Res -7520 23472 R180
WINDOW 0 36 76 Left 2
WINDOW 3 36 40 Left 2
SYMATTR InstName R47
SYMATTR Value 3k
SYMBOL Res -6464 23504 R0
SYMATTR InstName R48
SYMATTR Value 10k
SYMBOL Res -6432 23408 R180
WINDOW 0 36 76 Left 2
WINDOW 3 36 40 Left 2
SYMATTR InstName R49
SYMATTR Value 3k
SYMBOL Res -5424 23568 R180
WINDOW 0 36 76 Left 2
WINDOW 3 36 40 Left 2
SYMATTR InstName R50
SYMATTR Value 3k
SYMBOL Res -5456 23616 R0
SYMATTR InstName R51
SYMATTR Value 10k
SYMBOL LM13700 -8432 24928 R0
SYMATTR InstName U15
SYMBOL Res -8352 24656 R0
SYMATTR InstName R54
SYMATTR Value 10k
SYMBOL Res -8672 25440 R0
SYMATTR InstName R55
SYMATTR Value 150
SYMBOL Res -8480 25248 R90
WINDOW 0 0 56 VBottom 2
WINDOW 3 32 56 VTop 2
SYMATTR InstName R56
SYMATTR Value 10k
SYMBOL Res -8480 25360 R90
WINDOW 0 0 56 VBottom 2
WINDOW 3 32 56 VTop 2
SYMATTR InstName R57
SYMATTR Value 10k
SYMBOL Res -8592 24608 R0
SYMATTR InstName R58
SYMATTR Value 1000k
SYMBOL MCP6021 -7968 25120 R0
SYMATTR InstName U16
SYMBOL Res -10016 24944 R0
SYMATTR InstName R59
SYMATTR Value 200
SYMBOL Res -10016 24704 R0
SYMATTR InstName R60
SYMATTR Value 1k
SYMBOL Res -7920 25488 R0
SYMATTR InstName R61
SYMATTR Value 200
SYMBOL Res -7920 25248 R0
SYMATTR InstName R62
SYMATTR Value 1k
SYMBOL LM13700 -7248 24912 R0
SYMATTR InstName U17
SYMBOL Res -7168 24640 R0
SYMATTR InstName R63
SYMATTR Value 10k
SYMBOL Res -7488 25424 R0
SYMATTR InstName R64
SYMATTR Value 150
SYMBOL Res -7296 25232 R90
WINDOW 0 0 56 VBottom 2
WINDOW 3 32 56 VTop 2
SYMATTR InstName R65
SYMATTR Value 10k
SYMBOL Res -7296 25344 R90
WINDOW 0 0 56 VBottom 2
WINDOW 3 32 56 VTop 2
SYMATTR InstName R66
SYMATTR Value 10k
SYMBOL Res -7408 24592 R0
SYMATTR InstName R67
SYMATTR Value 1000k
SYMBOL MCP6021 -6784 25104 R0
SYMATTR InstName U18
SYMBOL Res -6736 25472 R0
SYMATTR InstName R68
SYMATTR Value 200
SYMBOL Res -6736 25232 R0
SYMATTR InstName R69
SYMATTR Value 1k
SYMBOL Res -7744 25488 R0
SYMATTR InstName R70
SYMATTR Value 200
SYMBOL Res -7744 25248 R0
SYMATTR InstName R71
SYMATTR Value 1k
SYMBOL LM13700 -9552 24928 R0
SYMATTR InstName U19
SYMBOL Res -9472 24656 R0
SYMATTR InstName R72
SYMATTR Value 10k
SYMBOL Res -9712 24608 R0
SYMATTR InstName R73
SYMATTR Value 1000k
SYMBOL Res -9808 25136 R0
SYMATTR InstName R74
SYMATTR Value 30
SYMBOL Res -9408 25168 R0
SYMATTR InstName R75
SYMATTR Value 110
TEXT -5608 19232 Left 2 !.tran 0 8m 10u 10n
TEXT -7336 18888 Left 5 ;Theremin Current Sensing Oscillator with PLL.
TEXT -6440 19000 Left 3 ;Variable Frequency \nBandpass Filter.\nHas zero phase shift \non middle frequency.
TEXT -6848 20384 Left 2 !.ic V(PT1)=2.23\n.ic V(PT2)=2.26

The netlist it stands for:
* vco_and_lc_drive_v17.asc
V1 COM 0 4.5
V2 VREF 0 2.25
L2 SENSE ANT 2mH Rser=120 Cpar=1pF
C_ant ANT 0 10pF
R35 N001 SENSE 3
V3 VREF12 0 1.2
Q105 VCOBIAS0 VCOBIAS0 N004 0 BC847B
R52 COM VCOBIAS0 10k
R53 N004 0 100
V4 DRV 0 PWL file=freq_sweep_100k_1500k.pwl
XU2 N003 N002 COM 0 N002 MCP6021  ; pins In+ In- V+ V- OUT
V5 CV 0 PWL(0 3 1m 3 8m 4.5)
V8 CV2 0 PWL(0 2 1000u 2 8m 4.5)
R5 N003 VREF 1k
XU4 N007 N013 N011 N017 PT1 0 NC_01 NC_02 COM LM13700/NS  ; pins Ibias Dio_bias in+ in- out V- buf_in buf_out V+
R20 CV2 N007 4.7k
C6 0 PT1 47p
R24 COM NC_03 2000k
R1 N009 VREF 10
XU5 PT1 BUF1 COM 0 BUF1 MCP6021  ; pins In+ In- V+ V- OUT
XU6 N005 NC_04 N009 N015 N011 0 NC_05 NC_06 COM LM13700/NS  ; pins Ibias Dio_bias in+ in- out V- buf_in buf_out V+
R4 COM N005 10k
R22 N011 N009 180
R8 N015 VREF 470
R9 BUF2 N015 10k
R2 N017 VREF 10
R10 BUF1 N017 10k
XU1 N008 N014 N012 N018 PT2 0 NC_07 NC_08 COM LM13700/NS  ; pins Ibias Dio_bias in+ in- out V- buf_in buf_out V+
R3 CV2 N008 4.7k
C1 0 PT2 47p
R6 COM NC_09 2000k
R7 N016 VREF 10
XU3 PT2 BUF2 COM 0 BUF2 MCP6021  ; pins In+ In- V+ V- OUT
XU7 N006 NC_10 N010 N016 N012 0 NC_11 NC_12 COM LM13700/NS  ; pins Ibias Dio_bias in+ in- out V- buf_in buf_out V+
R11 COM N006 10k
R12 N012 N016 180
R13 N010 VREF 470
R14 N010 BUF1 10k
R15 N018 VREF 10
R16 BUF2 N018 10k
XU8 N020 N028 PT55 N032 PT11 0 NC_13 NC_14 COM LM13700/NS  ; pins Ibias Dio_bias in+ in- out V- buf_in buf_out V+
R17 CV2 N020 10k
C2 PT11 BUF22 300p
R19 N032 VREF 150
R21 BUF11 N032 10k
XU10 N021 N029 N025 N033 PT22 0 NC_15 NC_16 COM LM13700/NS  ; pins Ibias Dio_bias in+ in- out V- buf_in buf_out V+
R18 CV2 N021 10k
C3 0 PT22 100p
R23 N033 VREF 270
R25 BUF22 N033 10k
R26 N025 VREF 220
R27 N025 BUF11 10k
R28 BUF22 N032 10k
R29 N024 DRV 1k
R30 N024 VREF 300
R31 COM NC_17 1000k
R32 COM NC_18 1000k
XU12 N022 N030 N026 N034 PT33 0 NC_19 NC_20 COM LM13700/NS  ; pins Ibias Dio_bias in+ in- out V- buf_in buf_out V+
R33 CV2 N022 10k
XU13 PT33 N038 COM 0 BUF33 MCP6021  ; pins In+ In- V+ V- OUT
R34 COM NC_21 1000k
R36 N026 VREF 240
R37 N026 BUF22 10k
R38 N034 VREF 200
R39 N034 BUF33 10k
C7 0 PT33 68p
XU14 N023 N031 N027 N035 PT55 0 NC_22 NC_23 COM LM13700/NS  ; pins Ibias Dio_bias in+ in- out V- buf_in buf_out V+
R40 COM N023 10k
R41 COM NC_24 1000k
R42 N027 VREF 30
R43 PT55 VREF 110
R44 N035 VREF 360
R45 N035 BUF33 10k
XU9 PT22 N036 COM 0 BUF22 MCP6021  ; pins In+ In- V+ V- OUT
XU11 PT11 N037 COM 0 BUF11 MCP6021  ; pins In+ In- V+ V- OUT
R46 N037 VREF 10k
R47 N037 BUF11 3k
R48 N036 VREF 10k
R49 N036 BUF22 3k
R50 N038 BUF33 3k
R51 N038 VREF 10k
XU15 N041 N046 PT000 N049 PT111 0 NC_25 NC_26 COM LM13700/NS  ; pins Ibias Dio_bias in+ in- out V- buf_in buf_out V+
R54 COM N041 10k
R55 N049 VREF 150
R56 NC_27 N049 10k
R57 NC_28 N049 10k
R58 COM N046 1000k
XU16 PT111 N051 COM 0 N051 MCP6021  ; pins In+ In- V+ V- OUT
R59 N043 VREF 200
R60 DRV N043 1k
R61 N048 VREF 200
R62 N051 N048 1k
XU17 N039 N044 N042 N047 PT222 0 NC_29 NC_30 COM LM13700/NS  ; pins Ibias Dio_bias in+ in- out V- buf_in buf_out V+
R63 COM N039 10k
R64 N047 VREF 150
R65 NC_31 N047 10k
R66 NC_32 N047 10k
R67 COM N044 1000k
XU18 PT222 N050 COM 0 N050 MCP6021  ; pins In+ In- V+ V- OUT
R68 NC_33 VREF 200
R69 N050 N043 1k
R70 N042 VREF 200
R71 N051 N042 1k
XU19 N040 N045 N043 N048 PT000 0 NC_34 NC_35 COM LM13700/NS  ; pins Ibias Dio_bias in+ in- out V- buf_in buf_out V+
R72 COM N040 10k
R73 COM NC_36 1000k
R74 NC_37 VREF 30
R75 PT000 VREF 110
.model NPN NPN
.model PNP PNP
.lib standard.bjt
.tran 0 8m 10u 10n
* Theremin Current Sensing Oscillator with PLL.
* Variable Frequency
* Bandpass Filter.
* Has zero phase shift
* on middle frequency.
.ic V(PT1)=2.23
.ic V(PT2)=2.26
.lib MCP6021.cir
.lib ns_models.lib
.backanno
.end